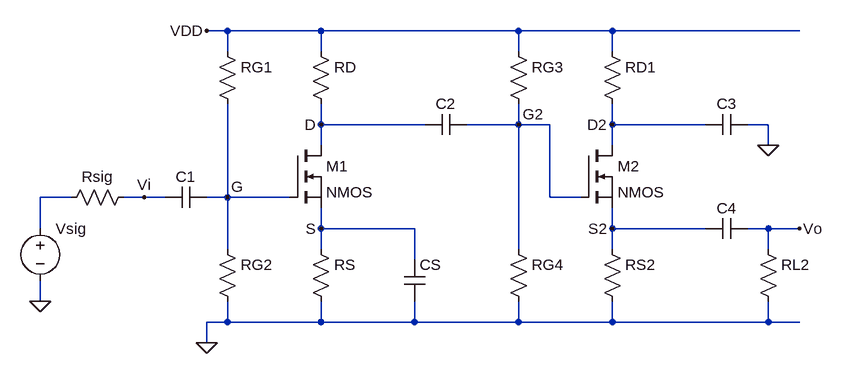
[diagram p0: schematic nmosWithSourceFollower.asc]
nmosWithSourceFollower.asc, the LTspice schematic file:
Version 4
SHEET 1 1296 680
WIRE 368 -144 336 -144
WIRE 512 -144 368 -144
WIRE 816 -144 512 -144
WIRE 960 -144 816 -144
WIRE 1248 -144 960 -144
WIRE 368 -112 368 -144
WIRE 512 -112 512 -144
WIRE 816 -112 816 -144
WIRE 960 -112 960 -144
WIRE 512 0 512 -32
WIRE 672 0 512 0
WIRE 816 0 816 -32
WIRE 816 0 736 0
WIRE 864 0 816 0
WIRE 960 0 960 -32
WIRE 1104 0 960 0
WIRE 1200 0 1168 0
WIRE 512 32 512 0
WIRE 960 32 960 0
WIRE 1200 32 1200 0
WIRE 128 112 80 112
WIRE 240 112 208 112
WIRE 272 112 240 112
WIRE 368 112 368 -32
WIRE 368 112 336 112
WIRE 464 112 368 112
WIRE 864 112 864 0
WIRE 912 112 864 112
WIRE 80 160 80 112
WIRE 512 160 512 128
WIRE 656 160 512 160
WIRE 960 160 960 128
WIRE 1104 160 960 160
WIRE 1200 160 1168 160
WIRE 1248 160 1200 160
WIRE 368 192 368 112
WIRE 512 192 512 160
WIRE 816 192 816 0
WIRE 960 192 960 160
WIRE 1200 192 1200 160
WIRE 656 208 656 160
WIRE 80 272 80 240
WIRE 368 304 368 272
WIRE 368 304 336 304
WIRE 512 304 512 272
WIRE 512 304 368 304
WIRE 656 304 656 272
WIRE 656 304 512 304
WIRE 816 304 816 272
WIRE 816 304 656 304
WIRE 960 304 960 272
WIRE 960 304 816 304
WIRE 1200 304 1200 272
WIRE 1200 304 960 304
WIRE 1248 304 1200 304
WIRE 336 336 336 304
FLAG 80 272 0
FLAG 240 112 Vi
FLAG 368 112 G
FLAG 512 0 D
FLAG 512 160 S
FLAG 336 -144 VDD
FLAG 336 336 0
FLAG 1200 32 0
FLAG 1248 160 Vo
FLAG 816 0 G2
FLAG 960 0 D2
FLAG 960 160 S2
SYMBOL voltage 80 144 R0
WINDOW 3 24 96 Invisible 2
SYMATTR InstName Vsig
SYMBOL res 224 96 R90
WINDOW 0 0 56 VBottom 2
WINDOW 3 32 56 Invisible 2
SYMATTR InstName Rsig
SYMBOL cap 336 96 R90
WINDOW 0 0 32 VBottom 2
WINDOW 3 32 32 Invisible 2
SYMATTR InstName C1
SYMBOL res 352 176 R0
WINDOW 3 36 76 Invisible 2
SYMATTR InstName RG2
SYMBOL res 352 -128 R0
WINDOW 3 36 76 Invisible 2
SYMATTR InstName RG1
SYMBOL nmos 464 32 R0
SYMATTR InstName M1
SYMBOL res 496 -128 R0
WINDOW 3 36 76 Invisible 2
SYMATTR InstName RD
SYMBOL res 496 176 R0
WINDOW 3 36 76 Invisible 2
SYMATTR InstName RS
SYMBOL cap 736 -16 R90
WINDOW 0 0 32 VBottom 2
WINDOW 3 32 32 Invisible 2
SYMATTR InstName C2
SYMBOL cap 640 208 R0
WINDOW 3 24 56 Invisible 2
SYMATTR InstName CS
SYMBOL res 800 -128 R0
WINDOW 3 36 76 Invisible 2
SYMATTR InstName RG3
SYMBOL res 800 176 R0
WINDOW 3 36 76 Invisible 2
SYMATTR InstName RG4
SYMBOL res 944 -128 R0
WINDOW 3 36 76 Invisible 2
SYMATTR InstName RD1
SYMBOL nmos 912 32 R0
SYMATTR InstName M2
SYMBOL res 944 176 R0
WINDOW 3 36 76 Invisible 2
SYMATTR InstName RS2
SYMBOL cap 1168 -16 R90
WINDOW 0 0 32 VBottom 2
WINDOW 3 32 32 Invisible 2
SYMATTR InstName C3
SYMBOL cap 1168 144 R90
WINDOW 0 0 32 VBottom 2
WINDOW 3 32 32 Invisible 2
SYMATTR InstName C4
SYMBOL res 1184 176 R0
WINDOW 3 36 76 Invisible 2
SYMATTR InstName RL2

The netlist it stands for:
* nmosWithSourceFollower.asc
Vsig N001 0 V
Rsig Vi N001 R
C1 G Vi C
RG2 G 0 R
RG1 VDD G R
M1 D G S S NMOS
RD VDD D R
RS S 0 R
C2 G2 D C
CS S 0 C
RG3 VDD G2 R
RG4 G2 0 R
RD1 VDD D2 R
M2 D2 G2 S2 S2 NMOS
RS2 S2 0 R
C3 0 D2 C
C4 Vo S2 C
RL2 Vo 0 R
.model NMOS NMOS
.model PMOS PMOS
.lib standard.mos
.backanno
.end